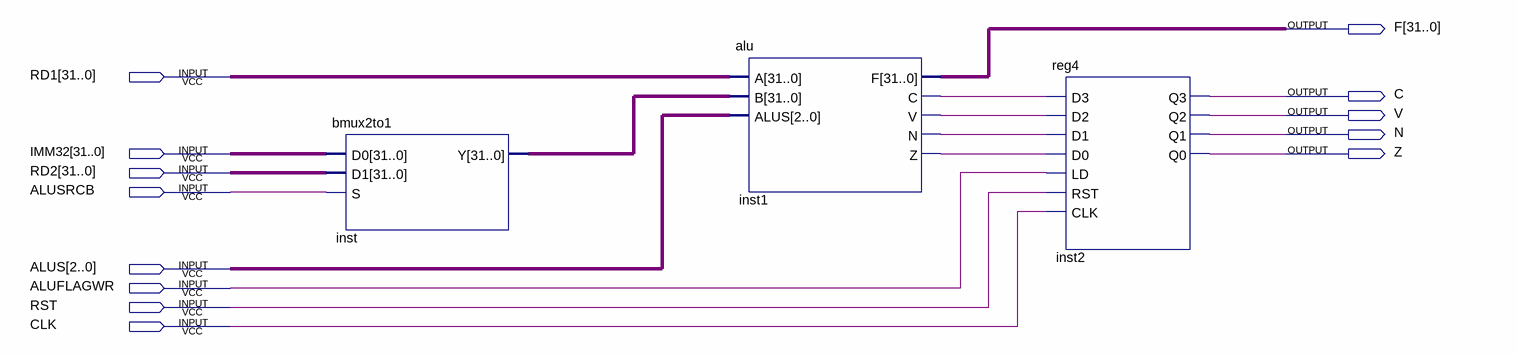
[diagram p0: schematic sheet]
// Quartus schematic execute.bdf as structural Verilog: 3 symbols, 13 pins
module execute (
  input  [31:0] RD1,
  input  [31:0] IMM32,
  input  [31:0] RD2,
  input  ALUSRCB,
  input  [2:0] ALUS,
  input  ALUFLAGWR,
  input  RST,
  input  CLK,
  output [31:0] F,
  output C,
  output V,
  output N,
  output Z
);

  wire inst1_c, inst1_n, inst1_v, inst1_z;
  wire [31:0] inst_y;

  bmux2to1 inst (.D0(IMM32), .D1(RD2), .S(ALUSRCB), .Y(inst_y));
  alu inst1 (.A(RD1), .B(inst_y), .ALUS(ALUS), .C(inst1_c), .V(inst1_v), .N(inst1_n), .Z(inst1_z), .F(F));
  reg4 inst2 (
    .D3(inst1_c), .D2(inst1_v), .D1(inst1_n), .D0(inst1_z), .LD(ALUFLAGWR), .RST(RST), .CLK(CLK), .Q3(C),
    .Q2(V), .Q1(N), .Q0(Z));
endmodule
